# Altium project main_module.PrjPcb
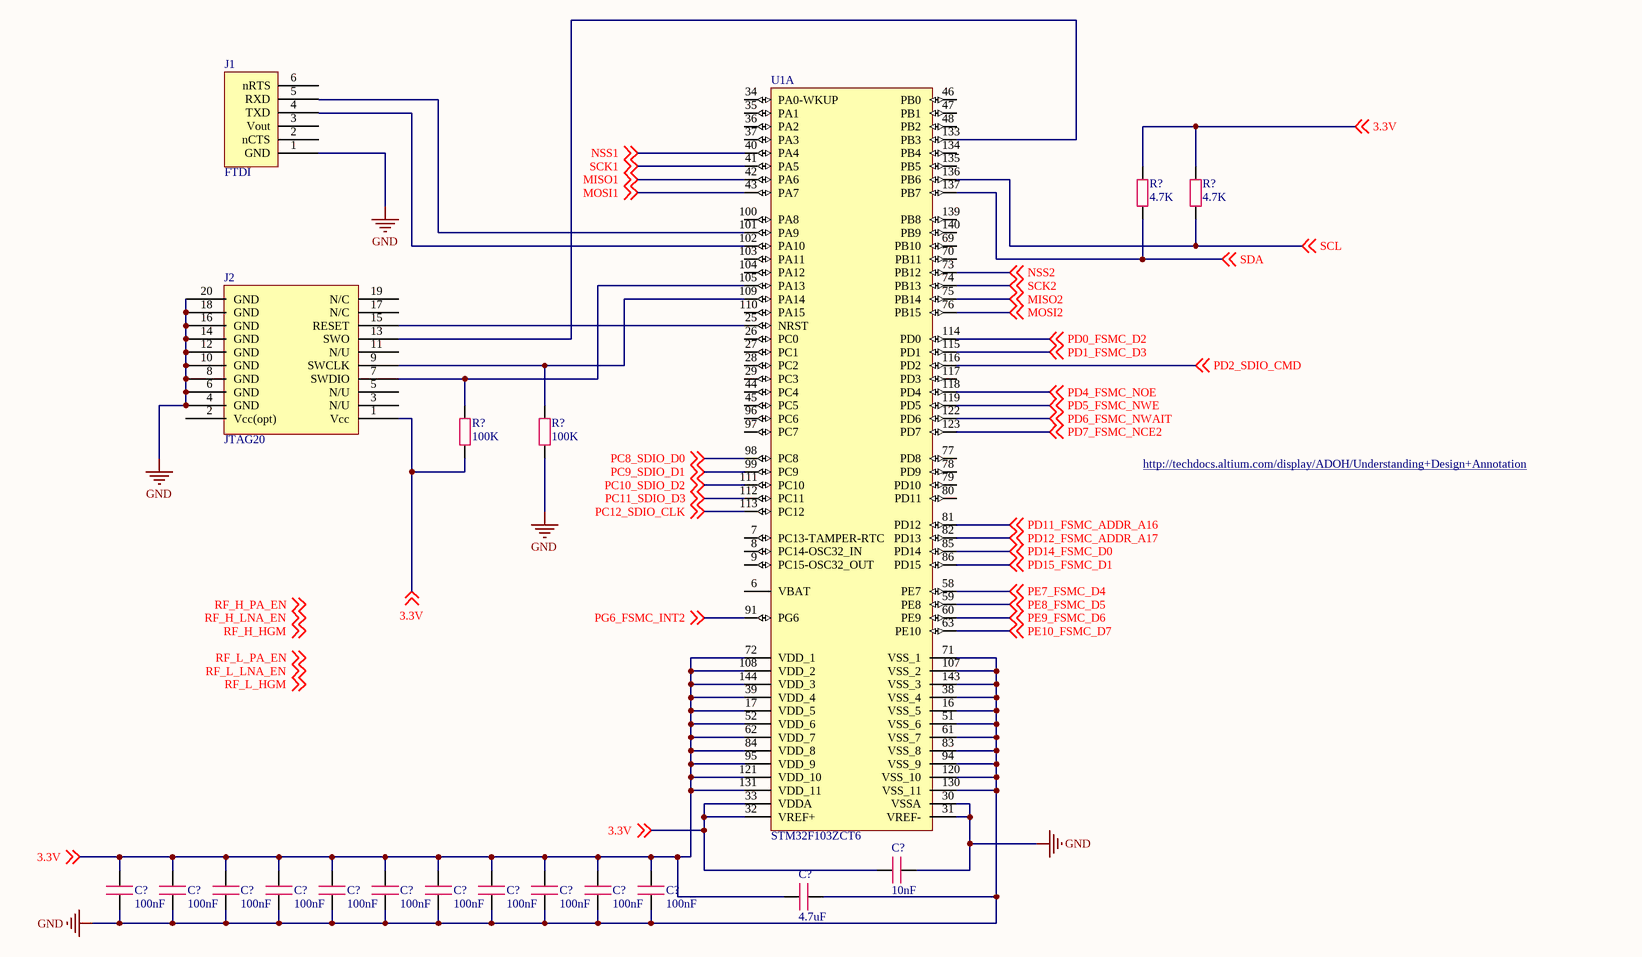
[diagram p0: main.SchDoc]
7 sheets, 158 parts. Net scope: global (net labels, ports and power ports of the same name join across sheets).
Board file: main.PcbDoc
Sheets:
  main.SchDoc
  pwm_driver.SchDoc
  radio_high.SchDoc
  radio_low.SchDoc
  sensors.SchDoc
  power_supply.SchDoc
  memory.SchDoc

## Sheet main.SchDoc
size A3; DocumentNumber: 1; SheetNumber: 1; SheetTotal: 4

### Parts
(Parts that share a designator on the sheet are numbered #1, #2 ... from top to bottom, then left to right.)
C?#1  value 10nF  [C0402]  (hidden comment: Capacity)
C?#2  value 100nF  [C0402]  (hidden comment: Capacity)
C?#3  value 100nF  [C0402]  (hidden comment: Capacity)
C?#4  value 100nF  [C0402]  (hidden comment: Capacity)
C?#5  value 100nF  [C0402]  (hidden comment: Capacity)
C?#6  value 100nF  [C0402]  (hidden comment: Capacity)
C?#7  value 100nF  [C0402]  (hidden comment: Capacity)
C?#8  value 100nF  [C0402]  (hidden comment: Capacity)
C?#9  value 100nF  [C0402]  (hidden comment: Capacity)
C?#10  value 100nF  [C0402]  (hidden comment: Capacity)
C?#11  value 100nF  [C0402]  (hidden comment: Capacity)
C?#12  value 100nF  [C0402]  (hidden comment: Capacity)
C?#13  value 4.7uF  [C0402]  (hidden comment: Capacity)
J1  FTDI
J2  JTAG20
R?#1  value 4.7K  [R0402]  (hidden comment: Resistor)
R?#2  value 4.7K  [R0402]  (hidden comment: Resistor)
R?#3  value 100K  [R0402]  (hidden comment: Resistor)
R?#4  value 100K  [R0402]  (hidden comment: Resistor)
U1  STM32F103ZCT6  [STM-LQFP144_M]  (part A of 3)

### Nets
GND: C?#1.1 C?#2.2 C?#3.2 C?#4.2 C?#5.2 C?#6.2 C?#7.2 C?#8.2 C?#9.2 C?#10.2 C?#11.2 C?#12.2 C?#13.1 J1.1(GND) J2.4(GND) J2.6(GND) J2.8(GND) J2.10(GND) J2.12(GND) J2.14(GND) J2.16(GND) J2.18(GND) J2.20(GND) R?#4.2 U1.16(VSS_5) U1.30(VSSA) U1.31(VREF-) U1.38(VSS_4) U1.51(VSS_6) U1.61(VSS_7) U1.71(VSS_1) U1.83(VSS_8) U1.94(VSS_9) U1.107(VSS_2) U1.120(VSS_10) U1.130(VSS_11) U1.143(VSS_3)
3.3V: C?#1.2 C?#2.1 C?#3.1 C?#4.1 C?#5.1 C?#6.1 C?#7.1 C?#8.1 C?#9.1 C?#10.1 C?#11.1 C?#12.1 C?#13.2 J2.1(Vcc) R?#1.1 R?#2.1 R?#3.2 U1.17(VDD_5) U1.32(VREF+) U1.33(VDDA) U1.39(VDD_4) U1.52(VDD_6) U1.62(VDD_7) U1.72(VDD_1) U1.84(VDD_8) U1.95(VDD_9) U1.108(VDD_2) U1.121(VDD_10) U1.131(VDD_11) U1.144(VDD_3) ; off-sheet 3.3V
MISO1: U1.42(PA6) ; off-sheet MISO1
MISO2: U1.75(PB14) ; off-sheet MISO2
MOSI1: U1.43(PA7) ; off-sheet MOSI1
MOSI2: U1.76(PB15) ; off-sheet MOSI2
NSS1: U1.40(PA4) ; off-sheet NSS1
NSS2: U1.73(PB12) ; off-sheet NSS2
PC8_SDIO_D0: U1.98(PC8) ; off-sheet PC8_SDIO_D0
PC9_SDIO_D1: U1.99(PC9) ; off-sheet PC9_SDIO_D1
PC10_SDIO_D2: U1.111(PC10) ; off-sheet PC10_SDIO_D2
PC11_SDIO_D3: U1.112(PC11) ; off-sheet PC11_SDIO_D3
PC12_SDIO_CLK: U1.113(PC12) ; off-sheet PC12_SDIO_CLK
PD0_FSMC_D2: U1.114(PD0) ; off-sheet PD0_FSMC_D2
PD1_FSMC_D3: U1.115(PD1) ; off-sheet PD1_FSMC_D3
PD2_SDIO_CMD: U1.116(PD2) ; off-sheet PD2_SDIO_CMD
PD4_FSMC_NOE: U1.118(PD4) ; off-sheet PD4_FSMC_NOE
PD5_FSMC_NWE: U1.119(PD5) ; off-sheet PD5_FSMC_NWE
PD6_FSMC_NWAIT: U1.122(PD6) ; off-sheet PD6_FSMC_NWAIT
PD7_FSMC_NCE2: U1.123(PD7) ; off-sheet PD7_FSMC_NCE2
PD11_FSMC_ADDR_A16: U1.81(PD12) ; off-sheet PD11_FSMC_ADDR_A16
PD12_FSMC_ADDR_A17: U1.82(PD13) ; off-sheet PD12_FSMC_ADDR_A17
PD14_FSMC_D0: U1.85(PD14) ; off-sheet PD14_FSMC_D0
PD15_FSMC_D1: U1.86(PD15) ; off-sheet PD15_FSMC_D1
PE7_FSMC_D4: U1.58(PE7) ; off-sheet PE7_FSMC_D4
PE8_FSMC_D5: U1.59(PE8) ; off-sheet PE8_FSMC_D5
PE9_FSMC_D6: U1.60(PE9) ; off-sheet PE9_FSMC_D6
PE10_FSMC_D7: U1.63(PE10) ; off-sheet PE10_FSMC_D7
PG6_FSMC_INT2: U1.91(PG6) ; off-sheet PG6_FSMC_INT2
RF_L_HGM: off-sheet RF_L_HGM, off-sheet RF_L_LNA_EN  [also labelled RF_L_LNA_EN]
SCK1: U1.41(PA5) ; off-sheet SCK1
SCK2: U1.74(PB13) ; off-sheet SCK2
SCL: R?#2.2 U1.136(PB6) ; off-sheet SCL
SDA: R?#1.2 U1.137(PB7) ; off-sheet SDA
NetJ2_7: J2.7(SWDIO) R?#3.1 U1.105(PA13)
NetJ2_9: J2.9(SWCLK) R?#4.1 U1.109(PA14)
NetJ2_13: J2.13(SWO) U1.133(PB3)
NetJ2_15: J2.15(RESET) U1.25(NRST)

Not connected (* = marked no-connect by the designer): J1 2(nCTS) 3(Vout) 4(TXD) 5(RXD) 6(nRTS); J2 2(Vcc(opt)) 3(N/U) 5(N/U) 11(N/U) 17(N/C) 19(N/C); U1 6(VBAT) 7(PC13-TAMPER-RTC) 8(PC14-OSC32_IN) 9(PC15-OSC32_OUT) 26(PC0) 27(PC1) 28(PC2) 29(PC3) 34(PA0-WKUP) 35(PA1) 36(PA2) 37(PA3) 44(PC4) 45(PC5) 46(PB0) 47(PB1) 48(PB2) 69(PB10) 70(PB11) 77(PD8) 78(PD9) 79(PD10) 80(PD11) 96(PC6) 97(PC7) 100(PA8) 101(PA9) 102(PA10) 103(PA11) 104(PA12) 110(PA15) 117(PD3) 134(PB4) 135(PB5) 139(PB8) 140(PB9)

### Notes on the sheet
- http://techdocs.altium.com/display/ADOH/Understanding+Design+Annotation
- Labels drawn without touching a wire or pin: RF_H_HGM, RF_H_LNA_EN, RF_H_PA_EN, RF_L_HGM, RF_L_LNA_EN, RF_L_PA_EN

### Library data of the parts
J1 = FTDI: FTDI 6-pin connector
J2 = JTAG20: SWD/JTAG 20 pin connector
U1 = STM32F103ZCT6: ARM Cortex-M3 32-bit MCU, 256 KB Flash, 48 KB Internal RAM, 112 I/Os, 144-pin LQFP, -40 to 85 degC, Tray; A/D Converter: 3x12-bit (21 Channel); D/A Converter: 2x12-bit (2 Channel); FLASH Size (Prog) (kB): 256; I/Os (High Current): 112; Internal RAM Size (kB): 48; Operating Frequency(F) (Processor speed) (MHz): 72; Supply Voltage(Vcc) min (V): 2; DatasheetVersion: Rev. 8; PackageVersion: Rev. 4, 06/2013; PackageReference: LQFP144; PackageDescription: 144-Pin Low Profile Quad Flat Package, 20 x 20 mm Body, 0.5 mm Pitch; Supplier 1: Digi-Key; Supplier Part Number 1: 497-11542-ND; Supplier 2: Farnell; Supplier Part Number 2: 1624142; Supplier 3: Newark; Supplier Part Number 3: 57P1265; Supplier 4: Mouser; Supplier Part Number 4: 511-STM32F103ZCT6; Core: ARM Cortex-M3; Packing: Tray; Mounting Technology: Surface Mount; PartNumber: STM32F103ZCT6; ComponentLink1Description: Manufacturer URL; ComponentLink1URL: http://www.st.com/web/en/home.html; ComponentLink2Description: Datasheet; ComponentLink2URL: http://www.st.com/st-web-ui/static/active/en/resource/technical/document/datasheet/CD00191185.pdf; ComponentLink3Description: Package Specification; ComponentLink3URL: http://www.st.com/st-web-ui/static/active/en/resource/technical/document/datasheet/DM00037051.pdf

## Sheet pwm_driver.SchDoc
size A3; DocumentNumber: 2; SheetNumber: 2; SheetTotal: 4
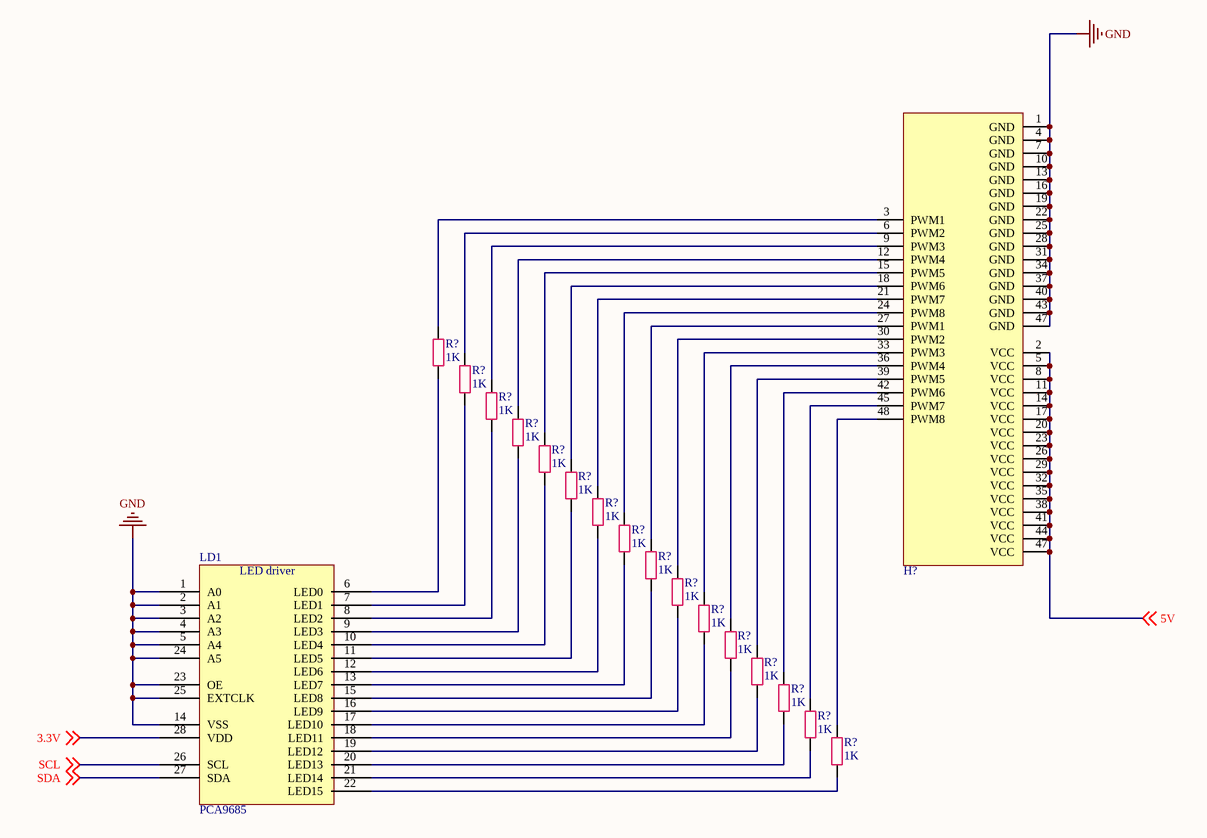
[diagram p1: pwm_driver.SchDoc]

### Parts
(Parts that share a designator on the sheet are numbered #1, #2 ... from top to bottom, then left to right.)
H?  PWM Header  [PWM_HEADER16]  (value not drawn)
LD1  PCA9685  [TSOP65P640X110-28N]
R?#5  value 1K  [R0402]  (hidden comment: Resistor)
R?#6  value 1K  [R0402]  (hidden comment: Resistor)
R?#7  value 1K  [R0402]  (hidden comment: Resistor)
R?#8  value 1K  [R0402]  (hidden comment: Resistor)
R?#9  value 1K  [R0402]  (hidden comment: Resistor)
R?#10  value 1K  [R0402]  (hidden comment: Resistor)
R?#11  value 1K  [R0402]  (hidden comment: Resistor)
R?#12  value 1K  [R0402]  (hidden comment: Resistor)
R?#13  value 1K  [R0402]  (hidden comment: Resistor)
R?#14  value 1K  [R0402]  (hidden comment: Resistor)
R?#15  value 1K  [R0402]  (hidden comment: Resistor)
R?#16  value 1K  [R0402]  (hidden comment: Resistor)
R?#17  value 1K  [R0402]  (hidden comment: Resistor)
R?#18  value 1K  [R0402]  (hidden comment: Resistor)
R?#19  value 1K  [R0402]  (hidden comment: Resistor)
R?#20  value 1K  [R0402]  (hidden comment: Resistor)

### Nets
GND: H?.1(GND) H?.4(GND) H?.7(GND) H?.10(GND) H?.13(GND) H?.16(GND) H?.19(GND) H?.22(GND) H?.25(GND) H?.28(GND) H?.31(GND) H?.34(GND) H?.37(GND) H?.40(GND) H?.43(GND) H?.47(GND) LD1.1(A0) LD1.2(A1) LD1.3(A2) LD1.4(A3) LD1.5(A4) LD1.14(VSS) LD1.23(OE) LD1.24(A5) LD1.25(EXTCLK)
3.3V: LD1.28(VDD) ; off-sheet 3.3V
5V: H?.2(VCC) H?.5(VCC) H?.8(VCC) H?.11(VCC) H?.14(VCC) H?.17(VCC) H?.20(VCC) H?.23(VCC) H?.26(VCC) H?.29(VCC) H?.32(VCC) H?.35(VCC) H?.38(VCC) H?.41(VCC) H?.44(VCC) H?.47(VCC) ; off-sheet 5V
SCL: LD1.26(SCL) ; off-sheet SCL
SDA: LD1.27(SDA) ; off-sheet SDA
NetH?_3: H?.3(PWM1) R?#5.2
NetH?_6: H?.6(PWM2) R?#6.2
NetH?_9: H?.9(PWM3) R?#7.2
NetH?_12: H?.12(PWM4) R?#8.2
NetH?_15: H?.15(PWM5) R?#9.2
NetH?_18: H?.18(PWM6) R?#10.2
NetH?_21: H?.21(PWM7) R?#11.2
NetH?_24: H?.24(PWM8) R?#12.2
NetH?_27: H?.27(PWM1) R?#13.2
NetH?_30: H?.30(PWM2) R?#14.2
NetH?_33: H?.33(PWM3) R?#15.2
NetH?_36: H?.36(PWM4) R?#16.2
NetH?_39: H?.39(PWM5) R?#17.2
NetH?_42: H?.42(PWM6) R?#18.2
NetH?_45: H?.45(PWM7) R?#19.2
NetH?_48: H?.48(PWM8) R?#20.2
NetLD1_6: LD1.6(LED0) R?#5.1
NetLD1_7: LD1.7(LED1) R?#6.1
NetLD1_8: LD1.8(LED2) R?#7.1
NetLD1_9: LD1.9(LED3) R?#8.1
NetLD1_10: LD1.10(LED4) R?#9.1
NetLD1_11: LD1.11(LED5) R?#10.1
NetLD1_12: LD1.12(LED6) R?#11.1
NetLD1_13: LD1.13(LED7) R?#12.1
NetLD1_15: LD1.15(LED8) R?#13.1
NetLD1_16: LD1.16(LED9) R?#14.1
NetLD1_17: LD1.17(LED10) R?#15.1
NetLD1_18: LD1.18(LED11) R?#16.1
NetLD1_19: LD1.19(LED12) R?#17.1
NetLD1_20: LD1.20(LED13) R?#18.1
NetLD1_21: LD1.21(LED14) R?#19.1
NetLD1_22: LD1.22(LED15) R?#20.1

### Notes on the sheet
- (in symbol PCA9685) LED driver

### Library data of the parts
H? = PWM Header: 16 channel PWM output header

## Sheet radio_high.SchDoc
size A3
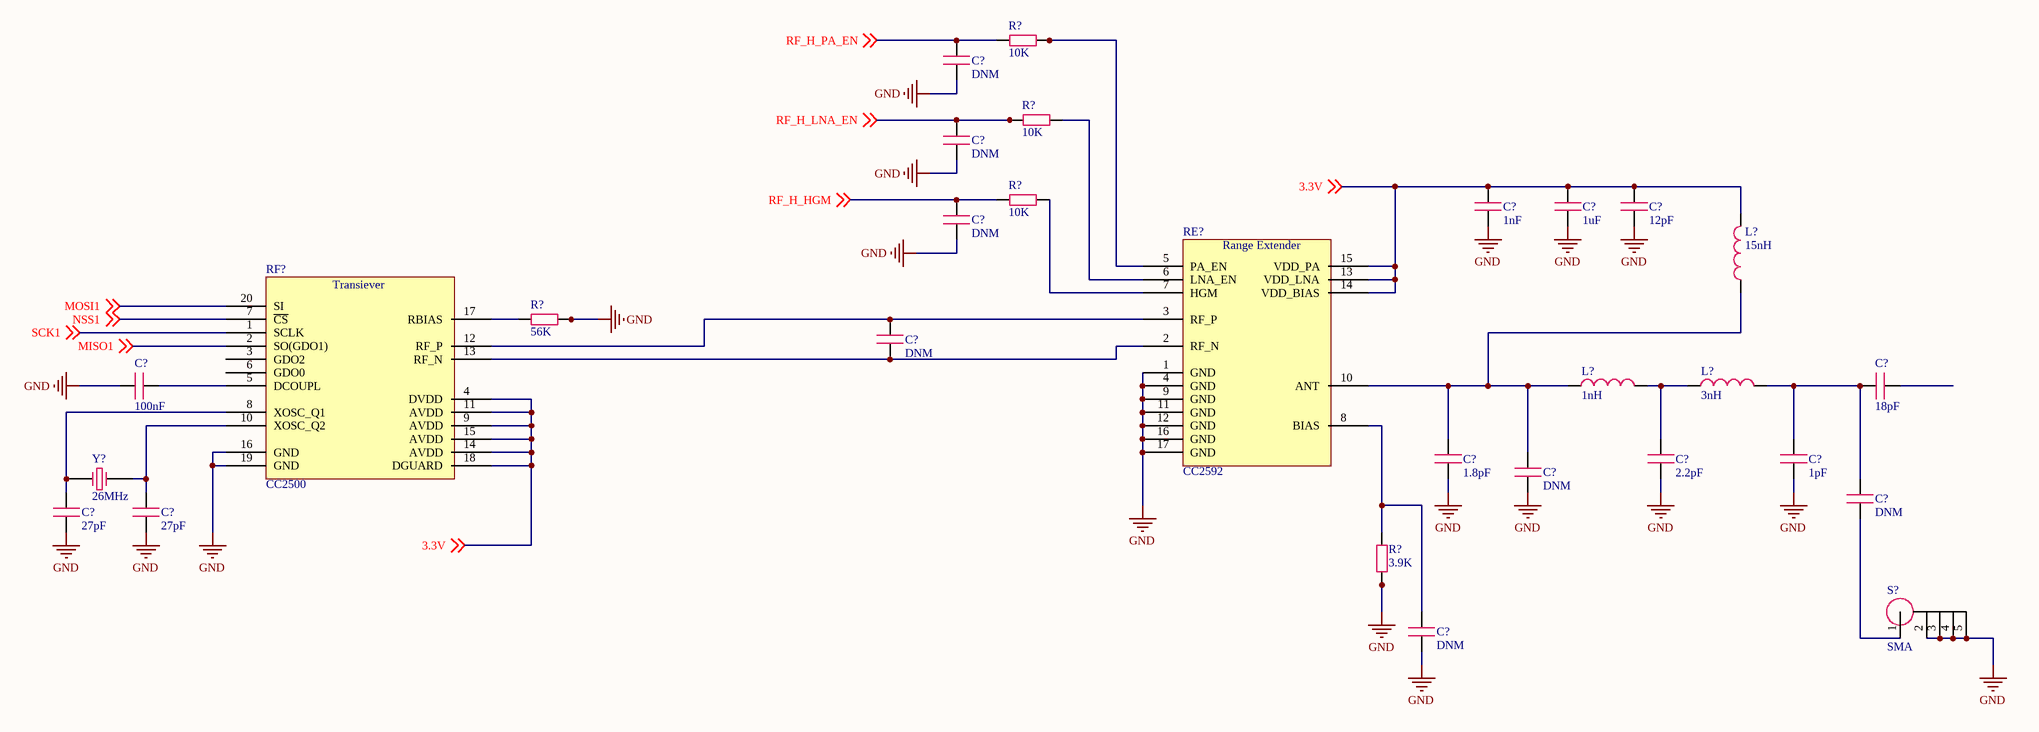
[diagram p2: radio_high.SchDoc]

### Parts
(Parts that share a designator on the sheet are numbered #1, #2 ... from top to bottom, then left to right.)
C?#14  value DNM  [C0402]  (hidden comment: Capacity)
C?#15  value DNM  [C0402]  (hidden comment: Capacity)
C?#16  value 1nF  [C0402]  (hidden comment: Capacity)
C?#17  value 1uF  [C0402]  (hidden comment: Capacity)
C?#18  value 12pF  [C0402]  (hidden comment: Capacity)
C?#19  value DNM  [C0402]  (hidden comment: Capacity)
C?#20  value DNM  [C0402]  (hidden comment: Capacity)
C?#21  value 100nF  [C0402]  (hidden comment: Capacity)
C?#22  value 18pF  [C0402]  (hidden comment: Capacity)
C?#23  value 1.8pF  [C0402]  (hidden comment: Capacity)
C?#24  value 2.2pF  [C0402]  (hidden comment: Capacity)
C?#25  value 1pF  [C0402]  (hidden comment: Capacity)
C?#26  value DNM  [C0402]  (hidden comment: Capacity)
C?#27  value DNM  [C0402]  (hidden comment: Capacity)
C?#28  value 27pF  [C0402]  (hidden comment: Capacity)
C?#29  value 27pF  [C0402]  (hidden comment: Capacity)
C?#30  value DNM  [C0402]  (hidden comment: Capacity)
L?#1  value 15nH  [L0402]  (hidden comment: Inductor)
L?#2  value 1nH  [L0402]  (hidden comment: Inductor)
L?#3  value 3nH  [L0402]  (hidden comment: Inductor)
R?#21  value 10K  [R0402]  (hidden comment: Resistor)
R?#22  value 10K  [R0402]  (hidden comment: Resistor)
R?#23  value 10K  [R0402]  (hidden comment: Resistor)
R?#24  value 56K  [R0402]  (hidden comment: Resistor)
R?#25  value 3.9K  [R0402]  (hidden comment: Resistor)
RE?  CC2592  [RGV16_2P16X2P16]
RF?  CC2500  [RTK20_2P4X2P4]
S?#1  SMA  [19-46-2_A]
Y?#1  Frequency: 26MHz  (hidden comment: Crystall)

### Nets
GND: C?#14.1 C?#15.1 C?#16.1 C?#17.1 C?#18.1 C?#19.1 C?#21.1 C?#23.1 C?#24.1 C?#25.1 C?#26.1 C?#28.2 C?#29.2 C?#30.1 R?#24.2 R?#25.1 RE?.1(GND) RE?.4(GND) RE?.9(GND) RE?.11(GND) RE?.12(GND) RE?.16(GND) RE?.17(GND) RF?.16(GND) RF?.19(GND) S?#1.2 S?#1.3 S?#1.4 S?#1.5
3.3V: C?#16.2 C?#17.2 C?#18.2 L?#1.2 RE?.13(VDD_LNA) RE?.14(VDD_BIAS) RE?.15(VDD_PA) RF?.4(DVDD) RF?.9(AVDD) RF?.11(AVDD) RF?.14(AVDD) RF?.15(AVDD) RF?.18(DGUARD) ; off-sheet 3.3V
MISO1: RF?.2(SO(GDO1)) ; off-sheet MISO1
MOSI1: RF?.20(SI) ; off-sheet MOSI1
NSS1: RF?.7(~{CS}) ; off-sheet NSS1
RF_H_HGM: C?#19.2 R?#23.1 ; off-sheet RF_H_HGM
RF_H_LNA_EN: C?#15.2 R?#22.1 ; off-sheet RF_H_LNA_EN
RF_H_PA_EN: C?#14.2 R?#21.1 ; off-sheet RF_H_PA_EN
SCK1: RF?.1(SCLK) ; off-sheet SCK1
NetC?#20_1: C?#20.1 RE?.2(RF_N) RF?.13(RF_N)
NetC?#20_2: C?#20.2 RE?.3(RF_P) RF?.12(RF_P)
NetC?#21_2: C?#21.2 RF?.5(DCOUPL)
NetC?#22_2: C?#22.2 C?#25.2 C?#27.2 L?#3.2
NetC?#23_2: C?#23.2 C?#26.2 L?#1.1 L?#2.1 RE?.10(ANT)
NetC?#24_2: C?#24.2 L?#2.2 L?#3.1
NetC?#27_1: C?#27.1 S?#1.1
NetC?#28_1: C?#28.1 RF?.8(XOSC_Q1) Y?#1.1(OSC1)
NetC?#29_1: C?#29.1 RF?.10(XOSC_Q2) Y?#1.2(OSC2)
NetC?#30_2: C?#30.2 R?#25.2 RE?.8(BIAS)
NetR?#21_2: R?#21.2 RE?.5(PA_EN)
NetR?#22_2: R?#22.2 RE?.6(LNA_EN)
NetR?#23_2: R?#23.2 RE?.7(HGM)
NetR?#24_1: R?#24.1 RF?.17(RBIAS)

Not connected (* = marked no-connect by the designer): C?#22 1; RF? 3(GDO2) 6(GDO0)

### Notes on the sheet
- (in symbol CC2500) Transiever
- (in symbol CC2592) Range Extender

### Library data of the parts
RE? = CC2592: Range Extender 2.5GHz
RF? = CC2500: 2.4GHz transiever
S?#1 = SMA: Antenna connector
Y?#1 = Crystall: Epson TSX-3225 MHz Crystal

## Sheet radio_low.SchDoc
size A3; PageSetup: Record=PageOptions|CenterHorizontal=True|CenterVertical=True|PrintScale=1.00|XCorrection=1.00|YCorrection=1.00|PrintKind=1|BorderSize=5000000|LeftOffset=0|BottomOffset=0|Orientation=2|PaperLength=1000|PaperWidth=1000|Scale=100|PaperSource=7|PrintQuality=-3|MediaType=1|DitherType=10|PrintScaleMode=1|PaperKind=A3|PaperIndex=8
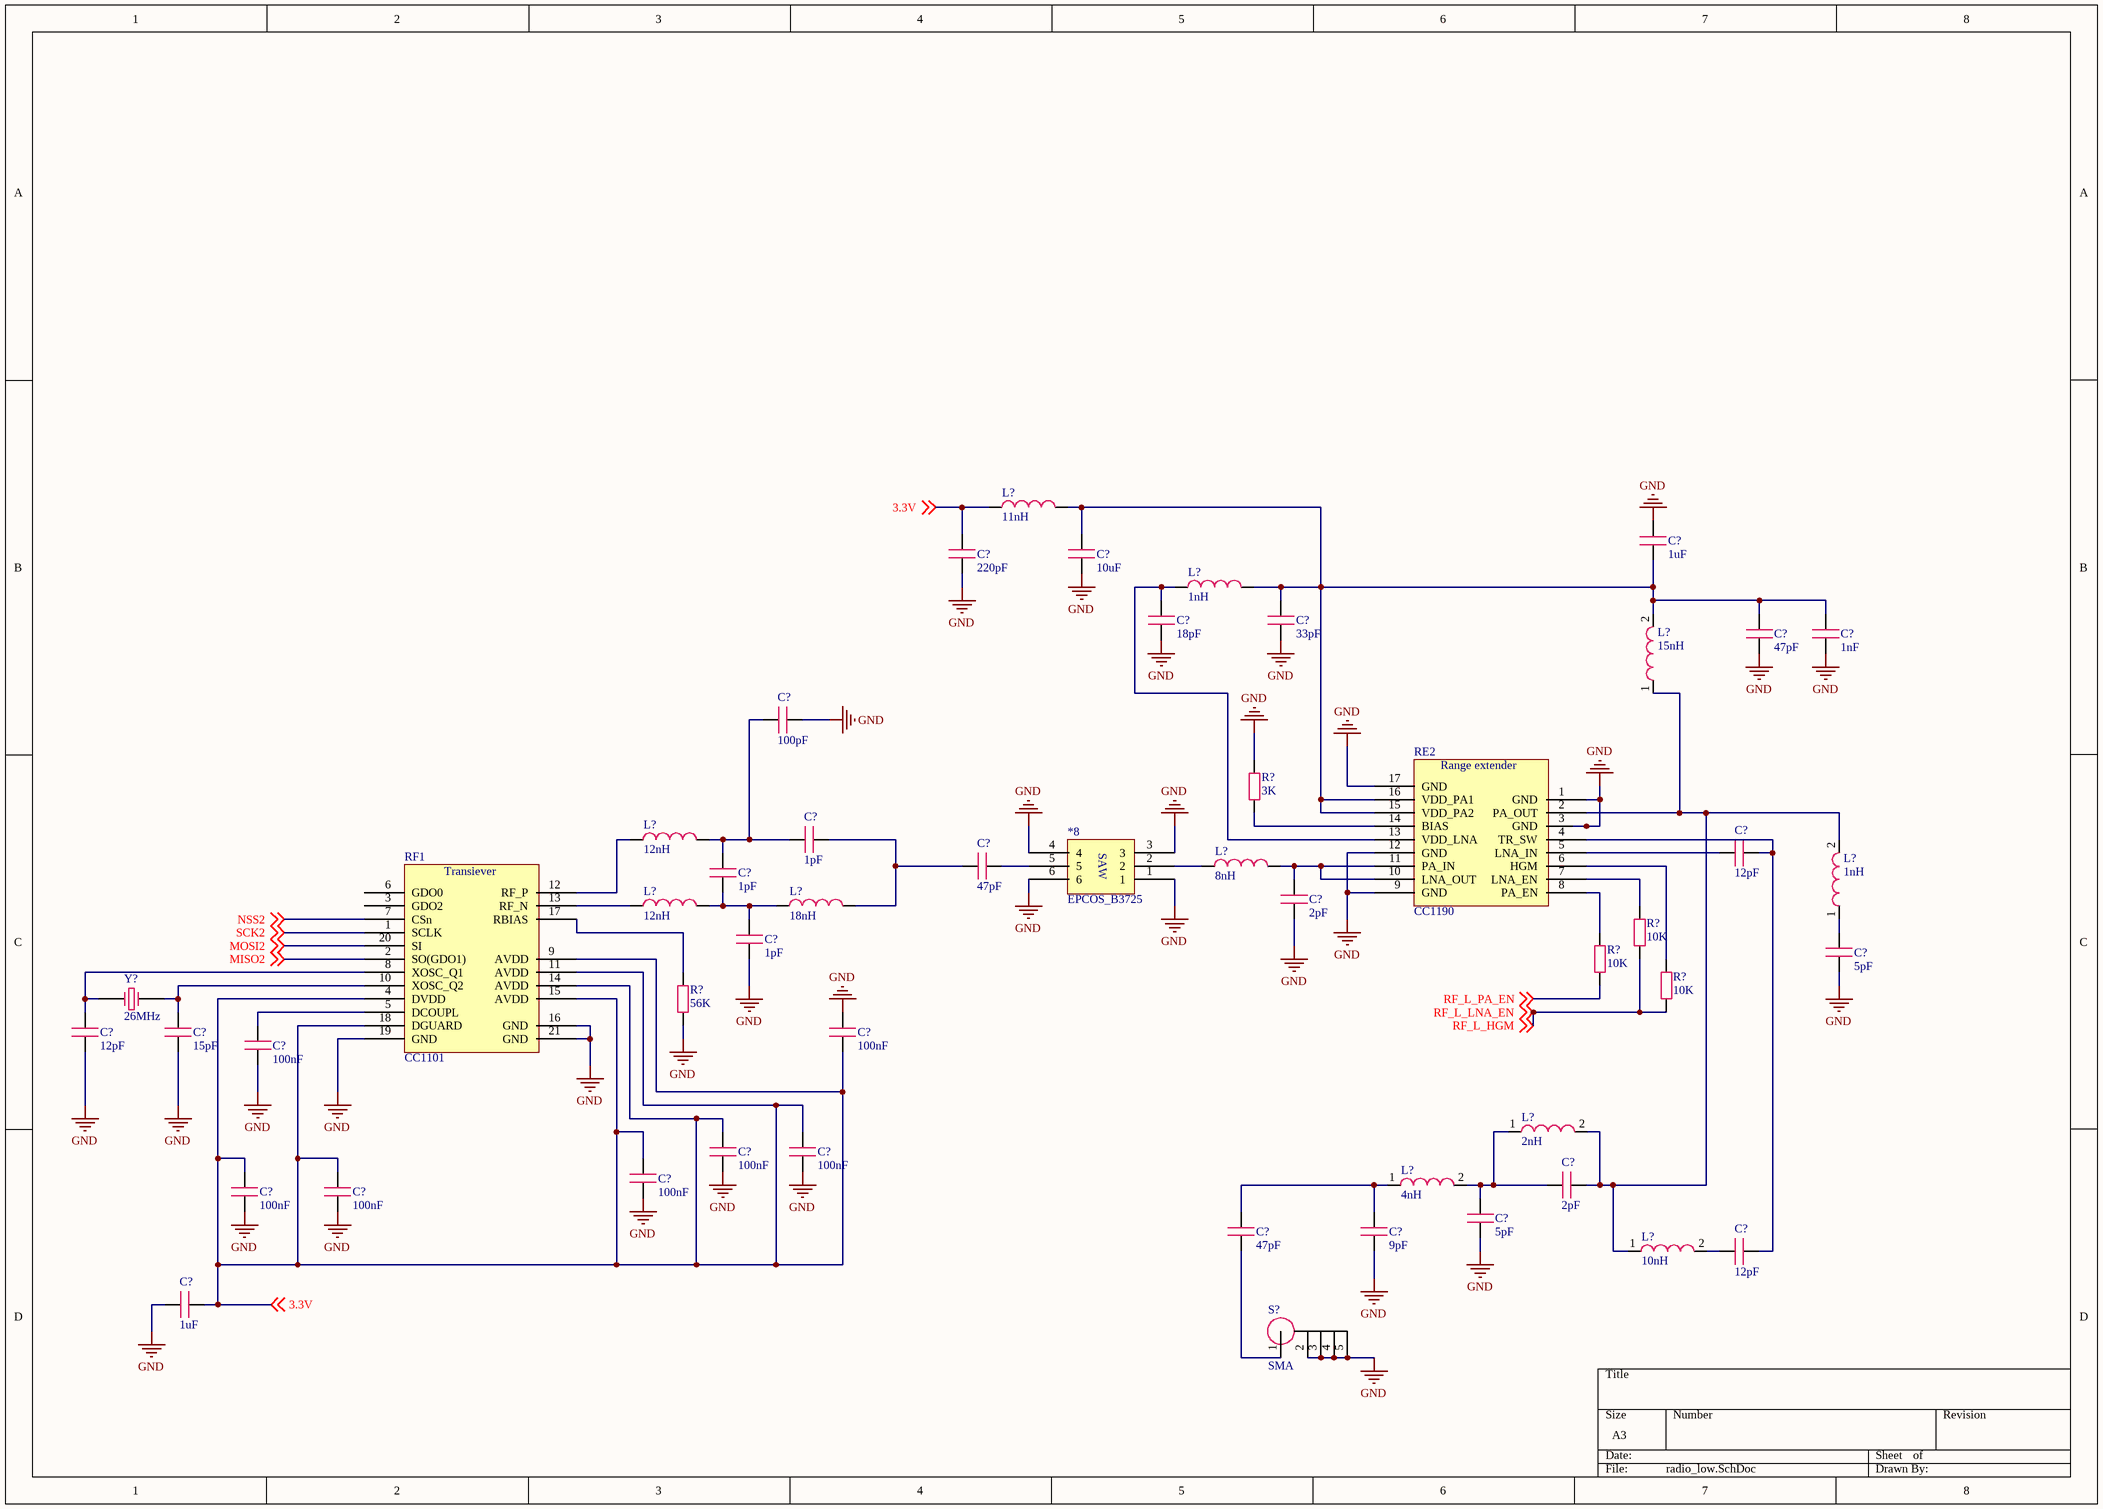
[diagram p3: radio_low.SchDoc]

### Parts
(Parts that share a designator on the sheet are numbered #1, #2 ... from top to bottom, then left to right.)
*8  EPCOS_B3725
C?#31  value 1uF  [C0402]  (hidden comment: Capacity)
C?#32  value 220pF  [C0402]  (hidden comment: Capacity)
C?#33  value 10uF  [C0402]  (hidden comment: Capacity)
C?#34  value 18pF  [C0402]  (hidden comment: Capacity)
C?#35  value 33pF  [C0402]  (hidden comment: Capacity)
C?#36  value 47pF  [C0402]  (hidden comment: Capacity)
C?#37  value 1nF  [C0402]  (hidden comment: Capacity)
C?#38  value 100pF  [C0402]  (hidden comment: Capacity)
C?#39  value 1pF  [C0402]  (hidden comment: Capacity)
C?#40  value 12pF  [C0402]  (hidden comment: Capacity)
C?#41  value 1pF  [C0402]  (hidden comment: Capacity)
C?#42  value 47pF  [C0402]  (hidden comment: Capacity)
C?#43  value 2pF  [C0402]  (hidden comment: Capacity)
C?#44  value 1pF  [C0402]  (hidden comment: Capacity)
C?#45  value 5pF  [C0402]  (hidden comment: Capacity)
C?#46  value 12pF  [C0402]  (hidden comment: Capacity)
C?#47  value 15pF  [C0402]  (hidden comment: Capacity)
C?#48  value 100nF  [C0402]  (hidden comment: Capacity)
C?#49  value 100nF  [C0402]  (hidden comment: Capacity)
C?#50  value 100nF  [C0402]  (hidden comment: Capacity)
C?#51  value 100nF  [C0402]  (hidden comment: Capacity)
C?#52  value 100nF  [C0402]  (hidden comment: Capacity)
C?#53  value 2pF  [C0402]  (hidden comment: Capacity)
C?#54  value 100nF  [C0402]  (hidden comment: Capacity)
C?#55  value 100nF  [C0402]  (hidden comment: Capacity)
C?#56  value 5pF  [C0402]  (hidden comment: Capacity)
C?#57  value 47pF  [C0402]  (hidden comment: Capacity)
C?#58  value 9pF  [C0402]  (hidden comment: Capacity)
C?#59  value 12pF  [C0402]  (hidden comment: Capacity)
C?#60  value 1uF  [C0402]  (hidden comment: Capacity)
L?#4  value 11nH  [L0402]  (hidden comment: Inductor)
L?#5  value 1nH  [L0402]  (hidden comment: Inductor)
L?#6  value 15nH  [L0402]  (hidden comment: Inductor)
L?#7  value 12nH  [L0402]  (hidden comment: Inductor)
L?#8  value 8nH  [L0402]  (hidden comment: Inductor)
L?#9  value 1nH  [L0402]  (hidden comment: Inductor)
L?#10  value 12nH  [L0402]  (hidden comment: Inductor)
L?#11  value 18nH  [L0402]  (hidden comment: Inductor)
L?#12  value 2nH  [L0402]  (hidden comment: Inductor)
L?#13  value 4nH  [L0402]  (hidden comment: Inductor)
L?#14  value 10nH  [L0402]  (hidden comment: Inductor)
R?#26  value 3K  [R0402]  (hidden comment: Resistor)
R?#27  value 10K  [R0402]  (hidden comment: Resistor)
R?#28  value 10K  [R0402]  (hidden comment: Resistor)
R?#29  value 10K  [R0402]  (hidden comment: Resistor)
R?#30  value 56K  [R0402]  (hidden comment: Resistor)
RE2  CC1190  [RGV16_2P16X2P16]
RF1  CC1101  [RGP20_2P4X2P4]
S?#2  SMA  [19-46-2_A]
Y?#2  Frequency: 26MHz  (hidden comment: Crystall)

### Nets
GND: *8.1 *8.3 *8.4 *8.6 C?#31.1 C?#32.2 C?#33.2 C?#34.2 C?#35.2 C?#36.2 C?#37.2 C?#38.2 C?#43.2 C?#44.1 C?#45.2 C?#46.2 C?#47.2 C?#48.1 C?#49.2 C?#50.2 C?#51.2 C?#52.2 C?#54.2 C?#55.2 C?#56.1 C?#58.1 C?#60.1 R?#26.2 R?#30.1 RE2.1(GND) RE2.3(GND) RE2.9(GND) RE2.12(GND) RE2.17(GND) RF1.16(GND) RF1.19(GND) RF1.21(GND) S?#2.2 S?#2.3 S?#2.4 S?#2.5
3.3V: C?#32.1 C?#48.2 C?#50.1 C?#51.1 C?#52.1 C?#54.1 C?#55.1 C?#60.2 L?#4.1 RF1.4(DVDD) RF1.9(AVDD) RF1.11(AVDD) RF1.14(AVDD) RF1.15(AVDD) RF1.18(DGUARD) ; off-sheet 3.3V
MISO2: RF1.2(SO(GDO1)) ; off-sheet MISO2
MOSI2: RF1.20(SI) ; off-sheet MOSI2
NSS2: RF1.7(CSn) ; off-sheet NSS2
RF_L_HGM: R?#27.1 R?#29.1 ; off-sheet RF_L_HGM, off-sheet RF_L_LNA_EN  [also labelled RF_L_LNA_EN]
RF_L_PA_EN: R?#28.1 ; off-sheet RF_L_PA_EN
SCK2: RF1.1(SCLK) ; off-sheet SCK2
Net*8_2: *8.2 L?#8.1
Net*8_5: *8.5 C?#42.2
NetC?#31_2: C?#31.2 C?#33.1 C?#35.1 C?#36.1 C?#37.1 L?#4.2 L?#5.2 L?#6.2 RE2.15(VDD_PA2) RE2.16(VDD_PA1)
NetC?#34_1: C?#34.1 L?#5.1 RE2.13(VDD_LNA)
NetC?#38_1: C?#38.1 C?#39.1 C?#41.2 L?#7.2
NetC?#39_2: C?#39.2 C?#42.1 L?#11.2
NetC?#40_1: C?#40.1 RE2.5(LNA_IN)
NetC?#40_2: C?#40.2 C?#59.2 RE2.4(TR_SW)
NetC?#41_1: C?#41.1 C?#44.2 L?#10.2 L?#11.1
NetC?#43_1: C?#43.1 L?#8.2 RE2.10(LNA_OUT) RE2.11(PA_IN)
NetC?#45_1: C?#45.1 L?#9.1
NetC?#46_1: C?#46.1 RF1.8(XOSC_Q1) Y?#2.1(OSC1)
NetC?#47_1: C?#47.1 RF1.10(XOSC_Q2) Y?#2.2(OSC2)
NetC?#49_1: C?#49.1 RF1.5(DCOUPL)
NetC?#53_1: C?#53.1 C?#56.2 L?#12.1 L?#13.2
NetC?#53_2: C?#53.2 L?#6.1 L?#9.2 L?#12.2 L?#14.1 RE2.2(PA_OUT)
NetC?#57_1: C?#57.1 S?#2.1
NetC?#57_2: C?#57.2 C?#58.2 L?#13.1
NetC?#59_1: C?#59.1 L?#14.2
NetL?#7_1: L?#7.1 RF1.12(RF_P)
NetL?#10_1: L?#10.1 RF1.13(RF_N)
NetR?#26_1: R?#26.1 RE2.14(BIAS)
NetR?#27_2: R?#27.2 RE2.7(LNA_EN)
NetR?#28_2: R?#28.2 RE2.8(PA_EN)
NetR?#29_2: R?#29.2 RE2.6(HGM)
NetR?#30_2: R?#30.2 RF1.17(RBIAS)

Not connected (* = marked no-connect by the designer): RF1 3(GDO2) 6(GDO0)

### Notes on the sheet
- (in symbol CC1101) Transiever
- (in symbol CC1190) Range extender
- (in symbol EPCOS_B3725) SAW

### Library data of the parts
*8 = EPCOS_B3725: Saw filter
RE2 = CC1190: 900MHZ range extender
RF1 = CC1101: 900MHz transiever
S?#2 = SMA: Antenna connector
Y?#2 = Crystall: Epson TSX-3225 MHz Crystal

## Sheet sensors.SchDoc
size A4; DocumentNumber: 3; SheetNumber: 3; SheetTotal: 4
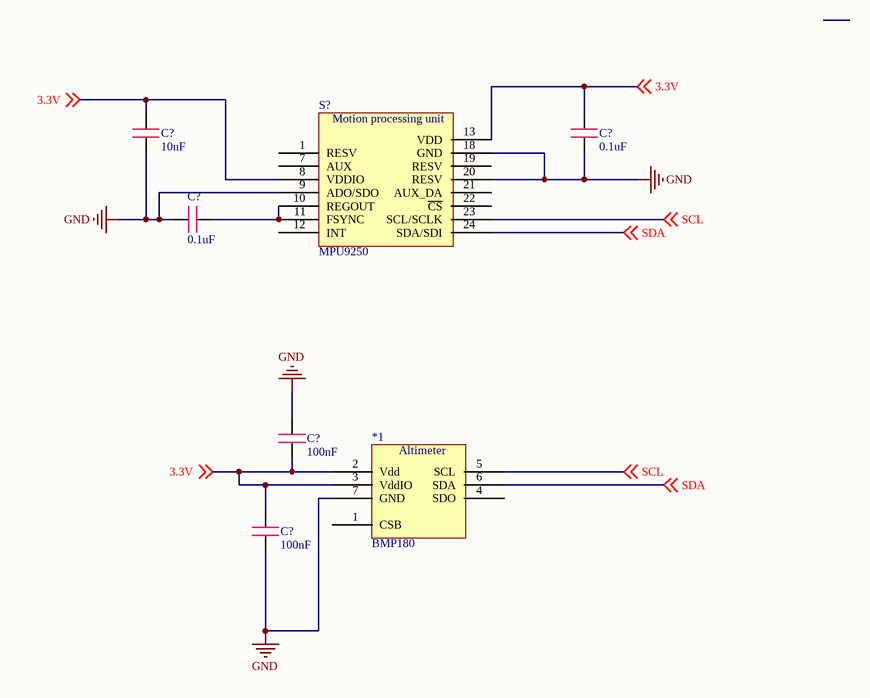
[diagram p4: sensors.SchDoc]

### Parts
(Parts that share a designator on the sheet are numbered #1, #2 ... from top to bottom, then left to right.)
*1  BMP180  [LGA7-1.5-3.8X3.6MM]
C?#61  value 10nF  [C0402]  (hidden comment: Capacity)
C?#62  value 0.1uF  [C0402]  (hidden comment: Capacity)
C?#63  value 0.1uF  [C0402]  (hidden comment: Capacity)
C?#64  value 100nF  [C0402]  (hidden comment: Capacity)
C?#65  value 100nF  [C0402]  (hidden comment: Capacity)
S?#3  MPU9250  [QFN40P300X300X100_HS-25N]

### Nets
GND: *1.7(GND) C?#61.2 C?#62.2 C?#63.2 C?#64.1 C?#65.2 S?#3.9(ADO/SDO) S?#3.18(GND) S?#3.20(RESV)
3.3V: *1.2(Vdd) *1.3(VddIO) C?#61.1 C?#62.1 C?#64.2 C?#65.1 S?#3.8(VDDIO) S?#3.13(VDD) ; off-sheet 3.3V
SCL: *1.5(SCL) S?#3.23(SCL/SCLK) ; off-sheet SCL
SDA: *1.6(SDA) S?#3.24(SDA/SDI) ; off-sheet SDA
NetC?#63_1: C?#63.1 S?#3.10(REGOUT) S?#3.11(FSYNC)

Not connected (* = marked no-connect by the designer): *1 1(CSB) 4(SDO); S?#3 1(RESV) 2(NC) 3(NC) 4(NC) 5(NC) 6(NC) 7(AUX) 12(INT) 14(NC) 15(NC) 16(NC) 17(NC) 19(RESV) 21(AUX_DA) 22(~{CS})

### Notes on the sheet
- (in symbol BMP180) Altimeter
- (in symbol MPU9250) Motion processing unit

### Library data of the parts
*1 = BMP180: Bosch Digital Pressure Sensor
S?#3 = MPU9250: Motion processing unit sensor

## Sheet power_supply.SchDoc
size A4; DocumentNumber: 4; SheetNumber: 4; SheetTotal: 4
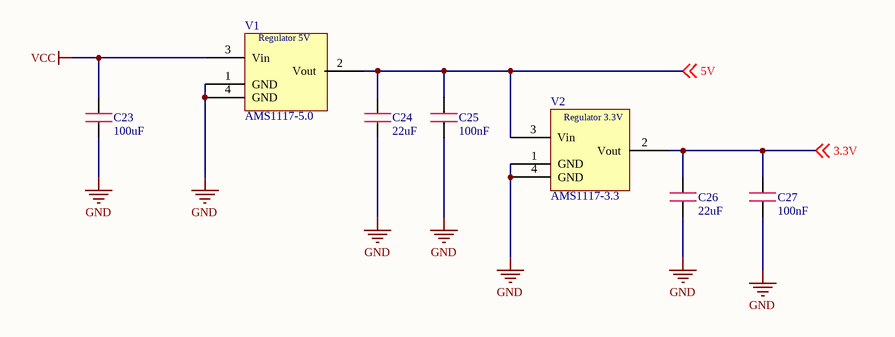
[diagram p5: power_supply.SchDoc]

### Parts
C23  value 100uF  [C0402]  (hidden comment: Capacity)
C24  value 22uF  [C0402]  (hidden comment: Capacity)
C25  value 100nF  [C0402]  (hidden comment: Capacity)
C26  value 22uF  [C0402]  (hidden comment: Capacity)
C27  value 100nF  [C0402]  (hidden comment: Capacity)
V1  AMS1117-5.0  [SOT-223]
V2  AMS1117-3.3  [SOT-223]

### Nets
GND: C23.2 C24.2 C25.2 C26.2 C27.2 V1.1(GND) V1.4(GND) V2.1(GND) V2.4(GND)
VCC: C23.1 V1.3(Vin)
3.3V: C26.1 C27.1 V2.2(Vout) ; off-sheet 3.3V
5V: C24.1 C25.1 V1.2(Vout) V2.3(Vin) ; off-sheet 5V

### Notes on the sheet
- (in symbol AMS1117-3.3) Regulator 3.3V
- (in symbol AMS1117-5.0) Regulator 5V

### Library data of the parts
V1 = AMS1117-5.0: Linear Voltage Regulator 5V
V2 = AMS1117-3.3: Linear Voltage Regulator 3.3V

## Sheet memory.SchDoc
size A4
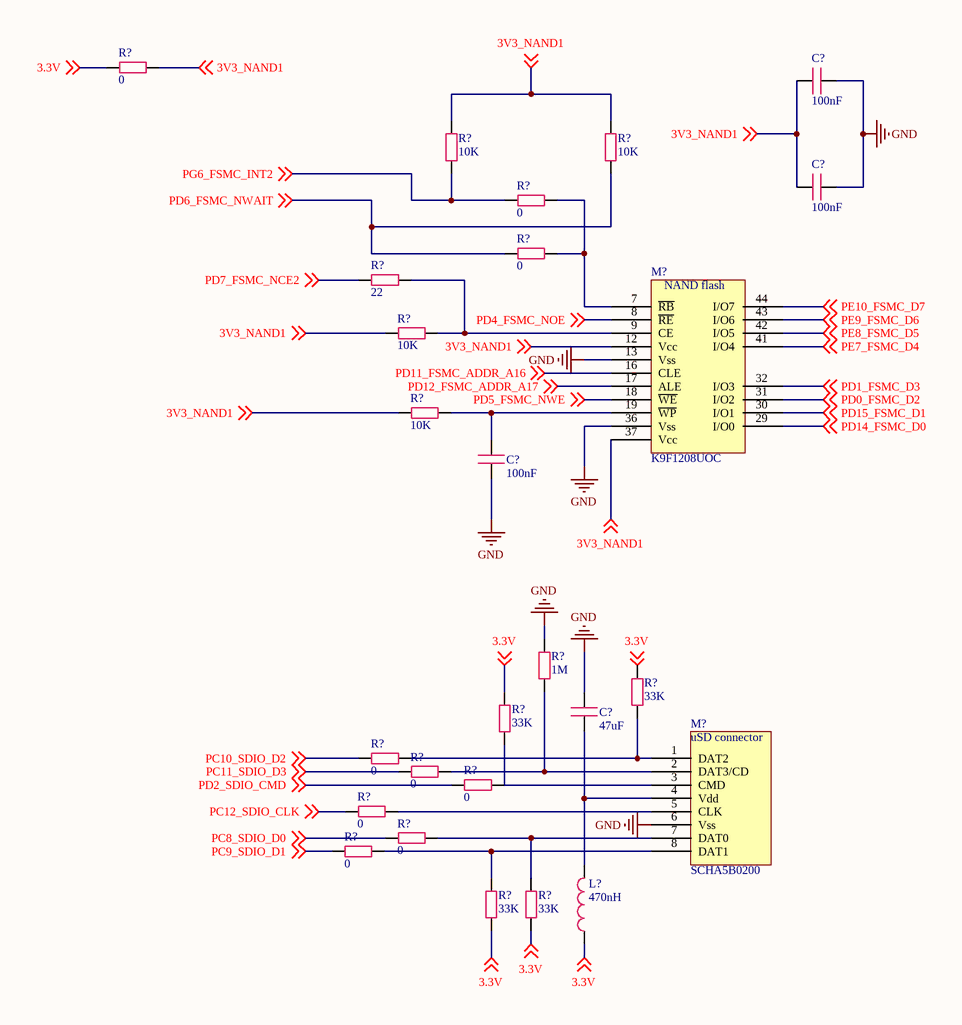
[diagram p6: memory.SchDoc]

### Parts
(Parts that share a designator on the sheet are numbered #1, #2 ... from top to bottom, then left to right.)
C?#66  value 100nF  [C0402]  (hidden comment: Capacity)
C?#67  value 100nF  [C0402]  (hidden comment: Capacity)
C?#68  value 100nF  [C0402]  (hidden comment: Capacity)
C?#69  value 47uF  [C0402]  (hidden comment: Capacity)
L?#15  value 470nH  [L0402]  (hidden comment: Inductor)
M?#1  K9F1208UOC  [TSSOP50P2000X120-48N]
M?#2  SCHA5B0200
R?#31  value 0  [R0402]  (hidden comment: Resistor)
R?#32  value 10K  [R0402]  (hidden comment: Resistor)
R?#33  value 10K  [R0402]  (hidden comment: Resistor)
R?#34  value 0  [R0402]  (hidden comment: Resistor)
R?#35  value 0  [R0402]  (hidden comment: Resistor)
R?#36  value 22  [R0402]  (hidden comment: Resistor)
R?#37  value 10K  [R0402]  (hidden comment: Resistor)
R?#38  value 10K  [R0402]  (hidden comment: Resistor)
R?#39  value 1M  [R0402]  (hidden comment: Resistor)
R?#40  value 33K  [R0402]  (hidden comment: Resistor)
R?#41  value 33K  [R0402]  (hidden comment: Resistor)
R?#42  value 0  [R0402]  (hidden comment: Resistor)
R?#43  value 0  [R0402]  (hidden comment: Resistor)
R?#44  value 0  [R0402]  (hidden comment: Resistor)
R?#45  value 0  [R0402]  (hidden comment: Resistor)
R?#46  value 0  [R0402]  (hidden comment: Resistor)
R?#47  value 0  [R0402]  (hidden comment: Resistor)
R?#48  value 33K  [R0402]  (hidden comment: Resistor)
R?#49  value 33K  [R0402]  (hidden comment: Resistor)

### Nets
GND: C?#66.2 C?#67.2 C?#68.2 C?#69.1 M?#1.13(Vss) M?#1.36(Vss) M?#2.6(Vss) R?#39.2
3.3V: L?#15.1 R?#31.2 R?#40.2 R?#41.2 R?#48.1 R?#49.1 ; off-sheet 3.3V
3V3_NAND1: C?#66.1 C?#67.1 M?#1.12(Vcc) M?#1.37(Vcc) R?#31.1 R?#32.1 R?#33.1 R?#37.2 R?#38.2 ; off-sheet 3V3_NAND1
PC8_SDIO_D0: R?#46.2 ; off-sheet PC8_SDIO_D0
PC9_SDIO_D1: R?#47.2 ; off-sheet PC9_SDIO_D1
PC10_SDIO_D2: R?#42.2 ; off-sheet PC10_SDIO_D2
PC11_SDIO_D3: R?#43.2 ; off-sheet PC11_SDIO_D3
PC12_SDIO_CLK: R?#45.2 ; off-sheet PC12_SDIO_CLK
PD0_FSMC_D2: M?#1.31(I/O2) ; off-sheet PD0_FSMC_D2
PD1_FSMC_D3: M?#1.32(I/O3) ; off-sheet PD1_FSMC_D3
PD2_SDIO_CMD: R?#44.2 ; off-sheet PD2_SDIO_CMD
PD4_FSMC_NOE: M?#1.8(~{RE}) ; off-sheet PD4_FSMC_NOE
PD5_FSMC_NWE: M?#1.18(~{WE}) ; off-sheet PD5_FSMC_NWE
PD6_FSMC_NWAIT: R?#33.2 R?#35.2 ; off-sheet PD6_FSMC_NWAIT
PD7_FSMC_NCE2: R?#36.2 ; off-sheet PD7_FSMC_NCE2
PD11_FSMC_ADDR_A16: M?#1.16(CLE) ; off-sheet PD11_FSMC_ADDR_A16
PD12_FSMC_ADDR_A17: M?#1.17(ALE) ; off-sheet PD12_FSMC_ADDR_A17
PD14_FSMC_D0: M?#1.29(I/O0) ; off-sheet PD14_FSMC_D0
PD15_FSMC_D1: M?#1.30(I/O1) ; off-sheet PD15_FSMC_D1
PE7_FSMC_D4: M?#1.41(I/O4) ; off-sheet PE7_FSMC_D4
PE8_FSMC_D5: M?#1.42(I/O5) ; off-sheet PE8_FSMC_D5
PE9_FSMC_D6: M?#1.43(I/O6) ; off-sheet PE9_FSMC_D6
PE10_FSMC_D7: M?#1.44(I/O7) ; off-sheet PE10_FSMC_D7
PG6_FSMC_INT2: R?#32.2 R?#34.2 ; off-sheet PG6_FSMC_INT2
NetC?#68_1: C?#68.1 M?#1.19(~{WP}) R?#38.1
NetC?#69_2: C?#69.2 L?#15.2 M?#2.4(Vdd)
NetM?#1_7: M?#1.7(~{RB}) R?#34.1 R?#35.1
NetM?#1_9: M?#1.9(CE) R?#36.1 R?#37.1
NetM?#2_1: M?#2.1(DAT2) R?#40.1 R?#42.1
NetM?#2_2: M?#2.2(DAT3/CD) R?#39.1 R?#43.1
NetM?#2_3: M?#2.3(CMD) R?#41.1 R?#44.1
NetM?#2_5: M?#2.5(CLK) R?#45.1
NetM?#2_7: M?#2.7(DAT0) R?#46.1 R?#49.2
NetM?#2_8: M?#2.8(DAT1) R?#47.1 R?#48.2

Not connected (* = marked no-connect by the designer): M?#1 1(NC) 2(NC) 3(NC) 4(NC) 5(NC) 6(NC) 10(NC) 11(NC) 14(NC) 15(NC) 20(NC) 21(NC) 22(NC) 23(NC) 24(NC) 25(NC) 26(NC) 27(NC) 28(NC) 33(NC) 34(NC) 35(NC) 38(NC) 39(NC) 40(NC) 45(NC) 46(NC) 47(NC) 48(NC)

### Notes on the sheet
- (in symbol K9F1208UOC) NAND flash
- (in symbol SCHA5B0200) uSD connector

### Library data of the parts
M?#1 = K9F1208UOC: 64x8 NAND flash; Volume: 64MB
M?#2 = SCHA5B0200: MicroSD connector

## Nets that join several sheets
GND: main (37 pins), pwm_driver (25 pins), radio_high (29 pins), radio_low (41 pins), sensors (9 pins), power_supply (9 pins), memory (8 pins)
3.3V: main (30 pins), pwm_driver (LD1.28), radio_high (13 pins), radio_low (15 pins), sensors (8 pins), power_supply (C26.1 C27.1 V2.2), memory (6 pins)
5V: pwm_driver (16 pins), power_supply (C24.1 C25.1 V1.2 V2.3)
MISO1: main (U1.42), radio_high (RF?.2)
MISO2: main (U1.75), radio_low (RF1.2)
MOSI1: main (U1.43), radio_high (RF?.20)
MOSI2: main (U1.76), radio_low (RF1.20)
NSS1: main (U1.40), radio_high (RF?.7)
NSS2: main (U1.73), radio_low (RF1.7)
PC8_SDIO_D0: main (U1.98), memory (R?#46.2)
PC9_SDIO_D1: main (U1.99), memory (R?#47.2)
PC10_SDIO_D2: main (U1.111), memory (R?#42.2)
PC11_SDIO_D3: main (U1.112), memory (R?#43.2)
PC12_SDIO_CLK: main (U1.113), memory (R?#45.2)
PD0_FSMC_D2: main (U1.114), memory (M?#1.31)
PD1_FSMC_D3: main (U1.115), memory (M?#1.32)
PD2_SDIO_CMD: main (U1.116), memory (R?#44.2)
PD4_FSMC_NOE: main (U1.118), memory (M?#1.8)
PD5_FSMC_NWE: main (U1.119), memory (M?#1.18)
PD6_FSMC_NWAIT: main (U1.122), memory (R?#33.2 R?#35.2)
PD7_FSMC_NCE2: main (U1.123), memory (R?#36.2)
PD11_FSMC_ADDR_A16: main (U1.81), memory (M?#1.16)
PD12_FSMC_ADDR_A17: main (U1.82), memory (M?#1.17)
PD14_FSMC_D0: main (U1.85), memory (M?#1.29)
PD15_FSMC_D1: main (U1.86), memory (M?#1.30)
PE7_FSMC_D4: main (U1.58), memory (M?#1.41)
PE8_FSMC_D5: main (U1.59), memory (M?#1.42)
PE9_FSMC_D6: main (U1.60), memory (M?#1.43)
PE10_FSMC_D7: main (U1.63), memory (M?#1.44)
PG6_FSMC_INT2: main (U1.91), memory (R?#32.2 R?#34.2)
SCK1: main (U1.41), radio_high (RF?.1)
SCK2: main (U1.74), radio_low (RF1.1)
SCL: main (R?#2.2 U1.136), pwm_driver (LD1.26), sensors (*1.5 S?#3.23)
SDA: main (R?#1.2 U1.137), pwm_driver (LD1.27), sensors (*1.6 S?#3.24)